# EAGLE design Neutron 1.4 (EAGLE 5.11)

## Sheet 1 of 4
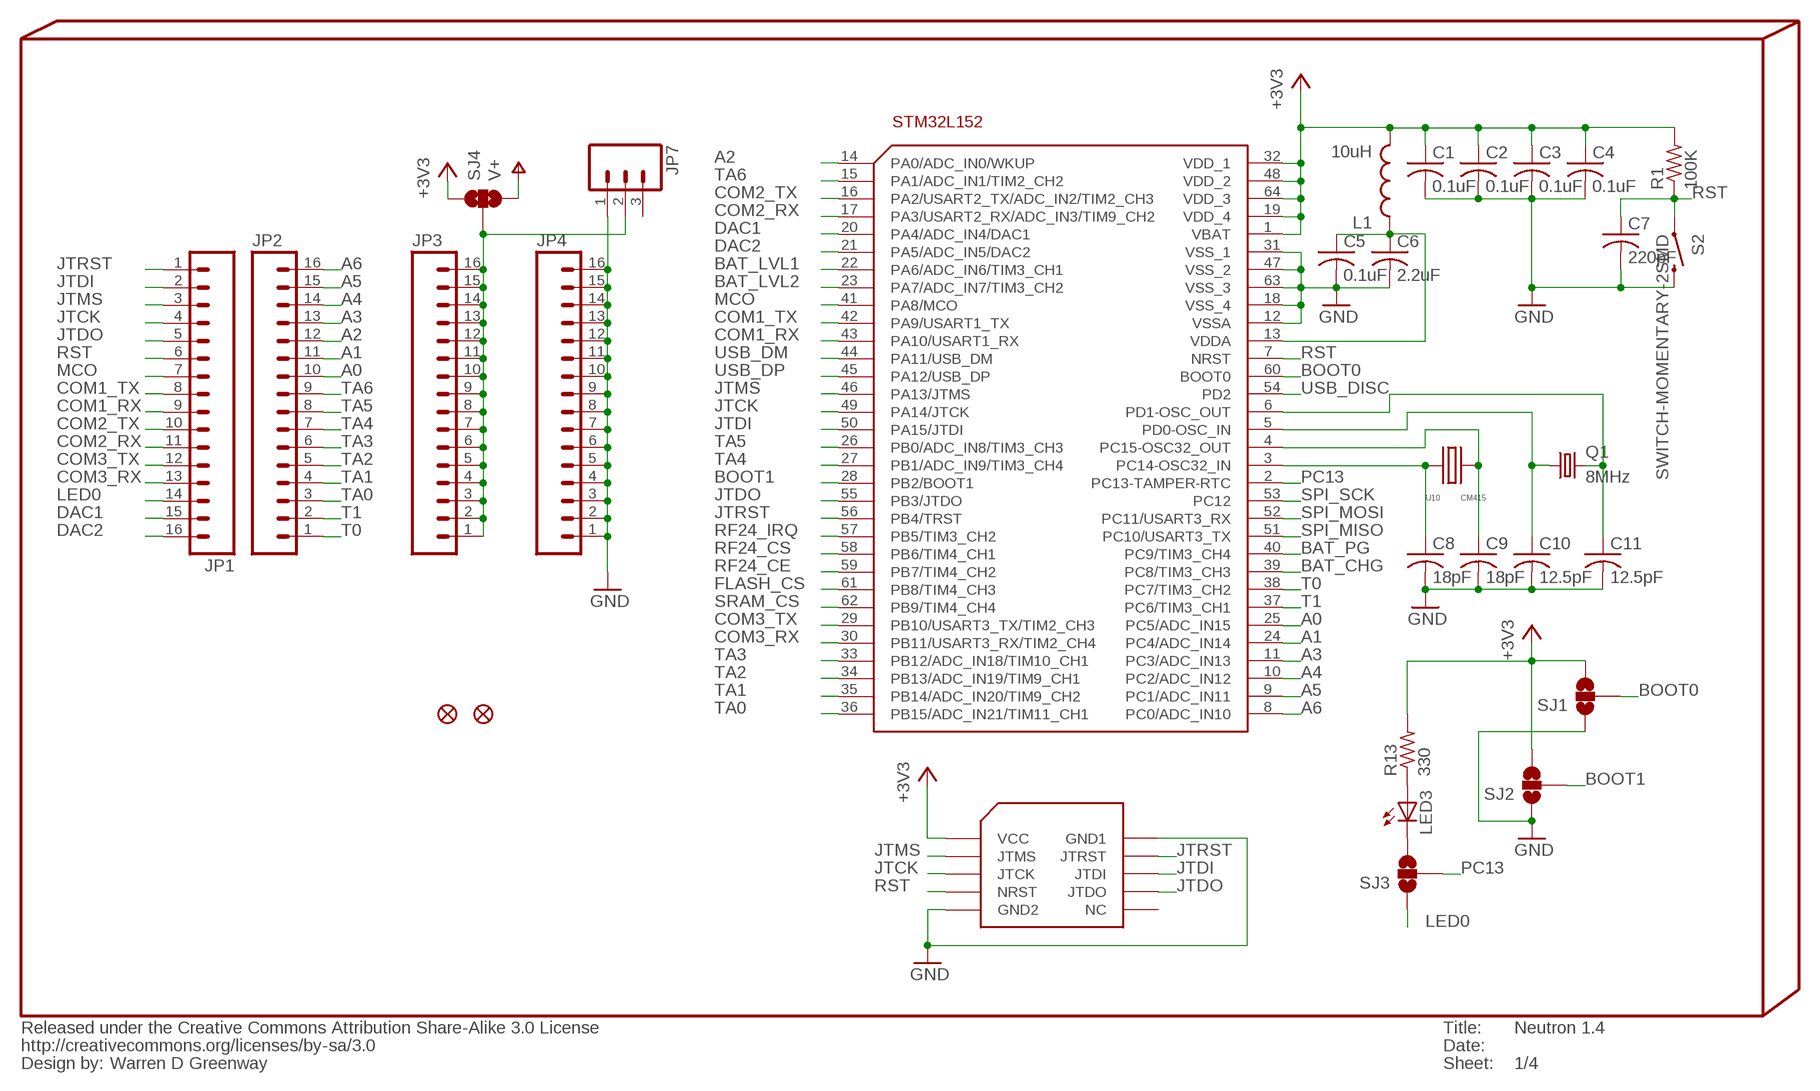
[diagram p0: schematic, sheet 1]

### Parts
C1  0.1uF  C-USC0402  [C0402]
C2  0.1uF  C-USC0402  [C0402]
C3  0.1uF  C-USC0402  [C0402]
C4  0.1uF  C-USC0402  [C0402]
C5  0.1uF  C-USC0402  [C0402]
C6  2.2uF  C-USC0402  [C0402]
C7  220pF  C-USC0402  [C0402]
C8  18pF  C-USC0402  [C0402]
C9  18pF  C-USC0402  [C0402]
C10  12.5pF  C-USC0402  [C0402]
C11  12.5pF  C-USC0402  [C0402]
INFO4  Warren D Greenway  CC-BY-SA  [CC-BY-SA]
JP1  M16ALTSILKLAYER  [1X16SS]
JP2  M16ALTSILKLAYER  [1X16SS]
JP3  M16ALTSILKLAYER  [1X16SS]
JP4  M16ALTSILKLAYER  [1X16SS]
JP7  M03ALTSILKLAYER  [1X03SS]
JP8  FIDUCIAL1.5X3  [FIDUCIAL-1.5X3]
JP9  FIDUCIAL1.5X3  [FIDUCIAL-1.5X3]
L1  10uH  INDUCTOR0603  [0603]
LED3  LED0603  [LED-0603]
Q1  8MHz  CRYSTAL5X3  [CRYSTAL-SMD-5X3]
R1  100K  R-US_R0402  [R0402]
R13  330  R-US_R0402  [R0402]
S2  SWITCH-MOMENTARY-2SMD  [SPARKFUN_TACTILE_SWITCH_SMD]
SJ1  SOLDERJUMPER_2WAYS  [SJ_3]
SJ2  SOLDERJUMPER_2WAYS  [SJ_3]
SJ3  SOLDERJUMPER_2WAYS  [SJ_3]
SJ4  SOLDERJUMPER_2WAYT  [SJ_2]
U1  STM32L152  [S-PQFP64-G64]
U10  CM415  [CM415]
U$2  STM32-JTAG-10P  [STM32-JTAG-10P]

### Nets
+3V3: C1.1 C2.1 C3.1 C4.1 L1.2 R1.2 R13.2 SJ1.3 SJ2.3 SJ4.1 U1.1(VBAT) U1.19(VDD_4) U1.32(VDD_1) U1.48(VDD_2) U1.64(VDD_3) U$2.P$1(VCC) ; also sheet 2,3,4
A0: JP2.10 U1.25(PC5/ADC_IN15)
A1: JP2.11 U1.24(PC4/ADC_IN14)
A2: JP2.12 U1.14(PA0/ADC_IN0/WKUP)
A3: JP2.13 U1.11(PC3/ADC_IN13)
A4: JP2.14 U1.10(PC2/ADC_IN12)
A5: JP2.15 U1.9(PC1/ADC_IN11)
A6: JP2.16 U1.8(PC0/ADC_IN10)
BAT_CHG: U1.39(PC8/TIM3_CH3) ; also sheet 3
BAT_LVL1: U1.22(PA6/ADC_IN6/TIM3_CH1) ; also sheet 3
BAT_LVL2: U1.23(PA7/ADC_IN7/TIM3_CH2) ; also sheet 3
BAT_PG: U1.40(PC9/TIM3_CH4) ; also sheet 3
BOOT0: SJ1.2 U1.60(BOOT0)
BOOT1: SJ2.2 U1.28(PB2/BOOT1)
COM1_RX: JP1.9 U1.43(PA10/USART1_RX)
COM1_TX: JP1.8 U1.42(PA9/USART1_TX)
COM2_RX: JP1.11 U1.17(PA3/USART2_RX/ADC_IN3/TIM9_CH2)
COM2_TX: JP1.10 U1.16(PA2/USART2_TX/ADC_IN2/TIM2_CH3)
COM3_RX: JP1.13 U1.30(PB11/USART3_RX/TIM2_CH4)
COM3_TX: JP1.12 U1.29(PB10/USART3_TX/TIM2_CH3)
DAC1: JP1.15 U1.20(PA4/ADC_IN4/DAC1)
DAC2: JP1.16 U1.21(PA5/ADC_IN5/DAC2)
FLASH_CS: U1.61(PB8/TIM4_CH3) ; also sheet 4
GND: C1.2 C2.2 C3.2 C4.2 C5.2 C6.2 C7.2 C8.2 C9.2 C10.2 C11.2 JP4.1 JP4.2 JP4.3 JP4.4 JP4.5 JP4.6 JP4.7 JP4.8 JP4.9 JP4.10 JP4.11 JP4.12 JP4.13 JP4.14 JP4.15 JP4.16 JP7.1 S2.3 SJ1.1 SJ2.1 U1.12(VSSA) U1.18(VSS_4) U1.31(VSS_1) U1.47(VSS_2) U1.63(VSS_3) U$2.P$2(GND1) U$2.P$9(GND2) ; also sheet 2,3,4
JTCK: JP1.4 U1.49(PA14/JTCK) U$2.P$5(JTCK)
JTDI: JP1.2 U1.50(PA15/JTDI) U$2.P$6(JTDI)
JTDO: JP1.5 U1.55(PB3/JTDO) U$2.P$8(JTDO)
JTMS: JP1.3 U1.46(PA13/JTMS) U$2.P$3(JTMS)
JTRST: JP1.1 U1.56(PB4/TRST) U$2.P$4(JTRST)
LED0: JP1.14 SJ3.1
MCO: JP1.7 U1.41(PA8/MCO)
N$1: C5.1 C6.1 L1.1 U1.13(VDDA)
N$2: C8.1 U1.3(PC14-OSC32_IN) U10.P$1(XIN)
N$4: C9.1 U1.4(PC15-OSC32_OUT) U10.P$2(XOUT)
N$5: C10.1 Q1.1 U1.5(PD0-OSC_IN)
N$6: C11.1 Q1.3 U1.6(PD1-OSC_OUT)
N$26: JP3.1 JP3.2 JP3.3 JP3.4 JP3.5 JP3.6 JP3.7 JP3.8 JP3.9 JP3.10 JP3.11 JP3.12 JP3.13 JP3.14 JP3.15 JP3.16 JP7.2 SJ4.2
N$35: LED3.C SJ3.3
N$36: LED3.A R13.1
PC13: SJ3.2 U1.2(PC13-TAMPER-RTC)
RF24_CE: U1.59(PB7/TIM4_CH2) ; also sheet 2
RF24_CS: U1.58(PB6/TIM4_CH1) ; also sheet 2
RF24_IRQ: U1.57(PB5/TIM3_CH2) ; also sheet 2
RST: C7.1 JP1.6 R1.1 S2.1 U1.7(NRST) U$2.P$7(NRST)
SPI_MISO: U1.51(PC10/USART3_TX) ; also sheet 2,4
SPI_MOSI: U1.52(PC11/USART3_RX) ; also sheet 2,4
SPI_SCK: U1.53(PC12) ; also sheet 2,4
SRAM_CS: U1.62(PB9/TIM4_CH4) ; also sheet 4
T0: JP2.1 U1.38(PC7/TIM3_CH2)
T1: JP2.2 U1.37(PC6/TIM3_CH1)
TA0: JP2.3 U1.36(PB15/ADC_IN21/TIM11_CH1)
TA1: JP2.4 U1.35(PB14/ADC_IN20/TIM9_CH2)
TA2: JP2.5 U1.34(PB13/ADC_IN19/TIM9_CH1)
TA3: JP2.6 U1.33(PB12/ADC_IN18/TIM10_CH1)
TA4: JP2.7 U1.27(PB1/ADC_IN9/TIM3_CH4)
TA5: JP2.8 U1.26(PB0/ADC_IN8/TIM3_CH3)
TA6: JP2.9 U1.15(PA1/ADC_IN1/TIM2_CH2)
USB_DISC: U1.54(PD2) ; also sheet 4
USB_DM: U1.44(PA11/USB_DM) ; also sheet 4
USB_DP: U1.45(PA12/USB_DP) ; also sheet 4
V+: SJ4.3 ; also sheet 3
Unconnected: JP7.3 U$2.P$10(NC)

## Sheet 2 of 4
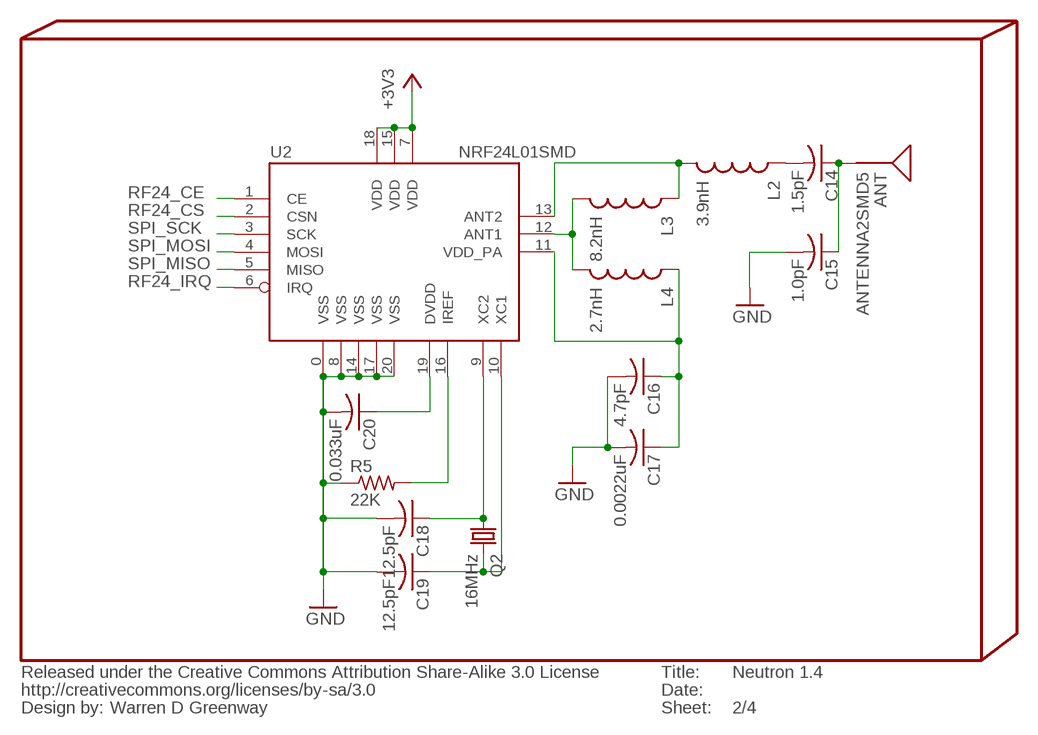
[diagram p1: schematic, sheet 2]

### Parts
ANT  ANTENNA2SMD5  [ANTENNA-CHIP5]
C14  1.5pF  C-USC0402  [C0402]
C15  1.0pF  C-USC0402  [C0402]
C16  4.7pF  C-USC0402  [C0402]
C17  0.0022uF  C-USC0402  [C0402]
C18  12.5pF  C-USC0402  [C0402]
C19  12.5pF  C-USC0402  [C0402]
C20  0.033uF  C-USC0402  [C0402]
L2  3.9nH  INDUCTOR0402  [C0402]
L3  8.2nH  INDUCTOR0402  [C0402]
L4  2.7nH  INDUCTOR0402  [C0402]
Q2  16MHz  CRYSTAL5X3  [CRYSTAL-SMD-5X3]
R5  22K  R-US_R0402  [R0402]
U2  NRF24L01SMD  [QFN20]

### Nets
+3V3: U2.7(VDD) U2.15(VDD) U2.18(VDD) ; also sheet 1,3,4
GND: C15.2 C16.2 C17.2 C18.2 C19.2 C20.2 R5.1 U2.0(VSS) U2.8(VSS) U2.14(VSS) U2.17(VSS) U2.20(VSS) ; also sheet 1,3,4
N$8: L3.2 L4.2 U2.12(ANT1)
N$10: ANT.FEED(SIGNAL) C14.1 C15.1
N$11: C14.2 L2.1
N$12: L2.2 L3.1 U2.13(ANT2)
N$13: C16.1 C17.1 L4.1 U2.11(VDD_PA)
N$14: C20.1 U2.19(DVDD)
N$15: R5.2 U2.16(IREF)
N$16: C18.1 Q2.1 U2.9(XC2)
N$17: C19.1 Q2.3 U2.10(XC1)
RF24_CE: U2.1(CE) ; also sheet 1
RF24_CS: U2.2(CSN) ; also sheet 1
RF24_IRQ: U2.6(IRQ) ; also sheet 1
SPI_MISO: U2.5(MISO) ; also sheet 1,4
SPI_MOSI: U2.4(MOSI) ; also sheet 1,4
SPI_SCK: U2.3(SCK) ; also sheet 1,4

## Sheet 3 of 4
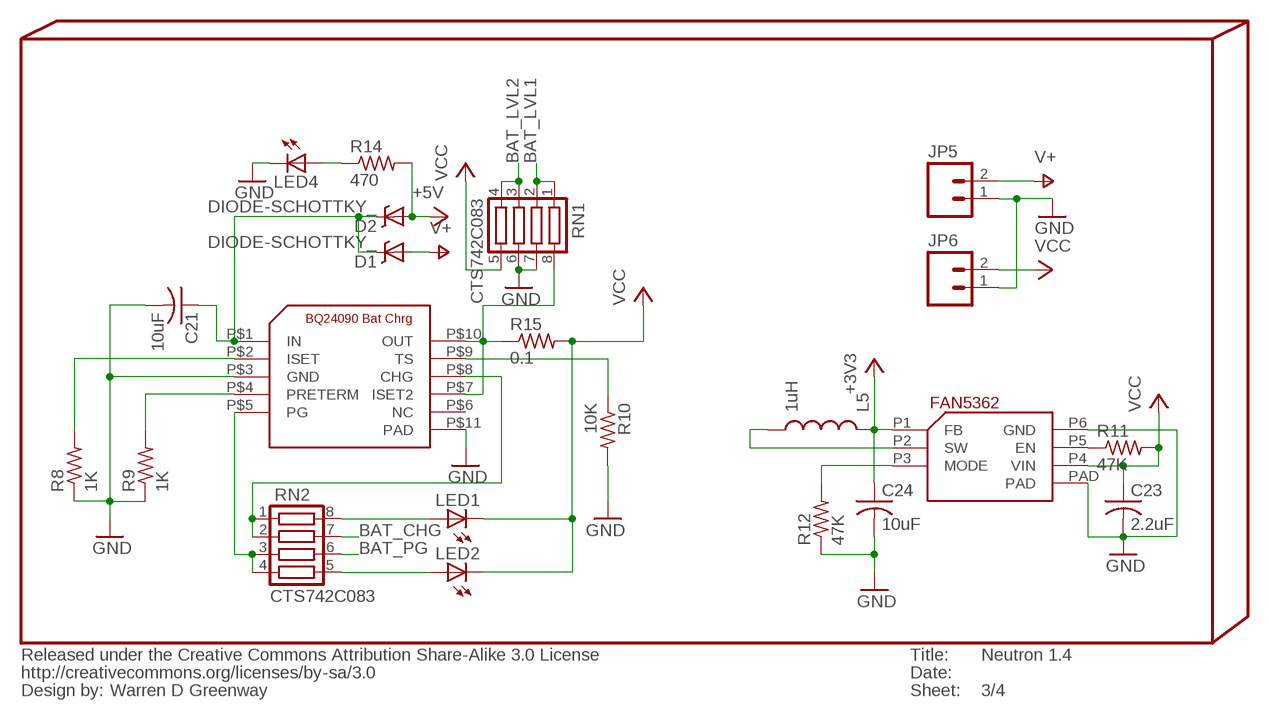
[diagram p2: schematic, sheet 3]

### Parts
C21  10uF  C-USC0805  [C0805]
C23  2.2uF  C-USC0402  [C0402]
C24  10uF  C-USC0805  [C0805]
D1  DIODE-SCHOTTKY_  [SMA-DIODE]
D2  DIODE-SCHOTTKY_  [SMA-DIODE]
JP5  M02JST-PTH-2  [JST-2-PTH]
JP6  M02JST-PTH-2  [JST-2-PTH]
L5  1uH  INDUCTOR0805  [0805]
LED1  LED0603  [LED-0603]
LED2  LED0603  [LED-0603]
LED4  LED0603  [LED-0603]
R8  1K  R-US_R0402  [R0402]
R9  1K  R-US_R0402  [R0402]
R10  10K  R-US_R0402  [R0402]
R11  47K  R-US_R0402  [R0402]
R12  47K  R-US_R0402  [R0402]
R14  470  R-US_R0402  [R0402]
R15  0.1  R-US_R0805  [R0805]
RN1  CTS742C083  [CTS742C083]
RN2  CTS742C083  [CTS742C083]
U3  BQ24090  [R-PDSO-G10]
U9  FAIRCHILD-REG-FAN5362  [MO229]

### Nets
+3V3: C24.1 L5.1 U9.P1(FB) ; also sheet 1,2,4
+5V: D2.A R14.2 ; also sheet 4
BAT_CHG: RN2.7 ; also sheet 1
BAT_LVL1: RN1.1 RN1.2 ; also sheet 1
BAT_LVL2: RN1.3 RN1.4 ; also sheet 1
BAT_PG: RN2.6 ; also sheet 1
GND: C21.2 C23.2 C24.2 JP5.1 JP6.1 LED4.C R8.1 R9.1 R10.2 R12.1 RN1.6 RN1.7 U3.P$3(GND) U3.P$11(PAD) U9.P6(GND) U9.PAD ; also sheet 1,2,4
N$18: R10.1 U3.P$9(TS)
N$19: RN2.3 RN2.4 U3.P$5(PG)
N$20: R9.2 U3.P$4(PRETERM)
N$21: R8.2 U3.P$2(ISET)
N$22: LED1.A RN2.8
N$24: LED2.A RN2.5
N$25: RN2.1 RN2.2 U3.P$8(CHG)
N$29: L5.2 U9.P2(SW)
N$31: LED4.A R14.1
N$32: R11.1 U9.P5(EN)
N$33: R12.2 U9.P3(MODE)
N$34: C21.1 D1.C D2.C U3.P$1(IN)
N$38: R15.1 RN1.8 U3.P$7(ISET2) U3.P$10(OUT)
V+: D1.A JP5.2 ; also sheet 1
VCC: C23.1 JP6.2 LED1.C LED2.C R11.2 R15.2 RN1.5 U9.P4(VIN)
Unconnected: U3.P$6(NC)

## Sheet 4 of 4
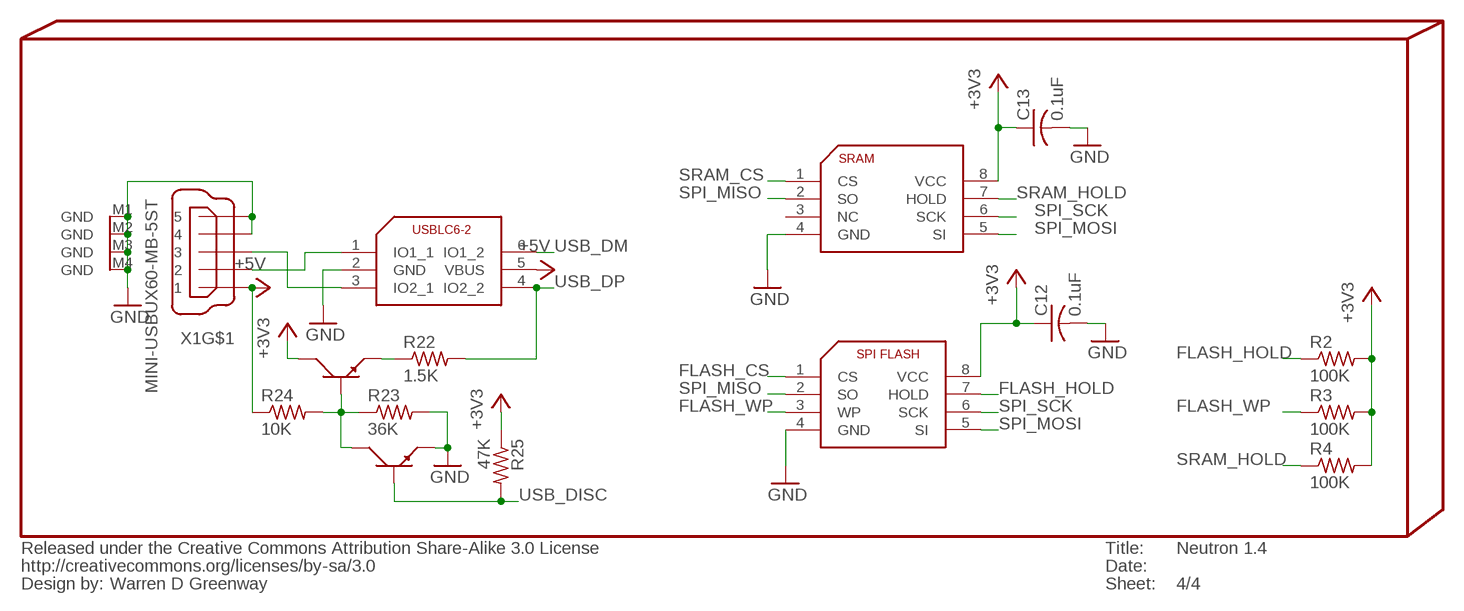
[diagram p3: schematic, sheet 4]

### Parts
C12  0.1uF  C-USC0402  [C0402]
C13  0.1uF  C-USC0402  [C0402]
R2  100K  R-US_R0402  [R0402]
R3  100K  R-US_R0402  [R0402]
R4  100K  R-US_R0402  [R0402]
R22  1.5K  R-US_R0402  [R0402]
R23  36K  R-US_R0402  [R0402]
R24  10K  R-US_R0402  [R0402]
R25  47K  R-US_R0402  [R0402]
U4  SST25VF080B  [DUBLIB_SOIC8]
U5  N25S0830HA  [TSSOP8]
U6  USBLC6-2  [SOT23-6L]
U7  BIPOLAR-PMBT6428  [DUBLIB_SOT23]
U8  BIPOLAR-PMBT6428  [DUBLIB_SOT23]
X1  MINI-USBUX60-MB-5ST  [DUBLIB_UX60-MB-5ST]

### Nets
+3V3: C12.1 C13.1 R2.2 R3.2 R4.2 R25.1 U4.8(VCC) U5.8(VCC) U7.3 ; also sheet 1,2,3
+5V: R24.1 U6.5(VBUS) X1.1 ; also sheet 3
FLASH_CS: U4.1(CS) ; also sheet 1
FLASH_HOLD: R2.1 U4.7(HOLD)
FLASH_WP: R3.1 U4.3(WP)
GND: C12.2 C13.2 R23.2 U4.4(GND) U5.4(GND) U6.2(GND) U8.2 X1.4 X1.5 X1.M1(GND) X1.M2(GND) X1.M3(GND) X1.M4(GND) ; also sheet 1,2,3
N$27: U6.3(IO2_1) X1.3
N$28: U6.1(IO1_1) X1.2
N$39: R23.1 R24.2 U7.1 U8.3
N$40: R22.1 U7.2
SPI_MISO: U4.2(SO) U5.2(SO) ; also sheet 1,2
SPI_MOSI: U4.5(SI) U5.5(SI) ; also sheet 1,2
SPI_SCK: U4.6(SCK) U5.6(SCK) ; also sheet 1,2
SRAM_CS: U5.1(CS) ; also sheet 1
SRAM_HOLD: R4.1 U5.7(HOLD)
USB_DISC: R25.2 U8.1 ; also sheet 1
USB_DM: U6.6(IO1_2) ; also sheet 1
USB_DP: R22.2 U6.4(IO2_2) ; also sheet 1
Unconnected: U5.3(NC)

## Library data of the parts
ANT = Pygmy:ANTENNA2: Antenna Single endded antenna. Common with smaller chip antennas. CHIP4 package is the GPS Chip Antenna SKU: GPS-08418. CHIP5 package is 2.4GHz chip antenna SKU: WRL-00144.
C1-C21 C23 C24 = rcl:C-US: CAPACITOR, American symbol
D1 D2 = SparkFun:DIODE-SCHOTTKY
INFO4 = Custom16:CC-BY-SA: Creative Commons Attribution-ShareAlike License <http://creativecommons.org/licenses/by-sa/3.0/>
JP1-JP4 = Pygmy:M16
JP5 JP6 = SparkFun:M02: Header 2 Standard 2-pin 0.1" header. Use with straight break away headers (SKU : PRT-00116), right angle break away headers (PRT-00553), swiss pins (PRT-00743), machine pins (PRT-00117), and female headers (PRT-00115). Molex polarized connector foot print use with SKU : PRT-08233 with associated crimp pins and housings.
JP7 = Pygmy:M03: Header 3 Standard 3-pin 0.1" header. Use with straight break away headers (SKU : PRT-00116), right angle break away headers (PRT-00553), swiss pins (PRT-00743), machine pins (PRT-00117), and female headers (PRT-00115). Molex polarized connector foot print use with SKU : PRT-08232 with associated crimp pins and housings.
JP8 JP9 = SparkFun:FIDUCIAL: Fiducial Alignment Points Various fiducial points for machine vision alignment.
L1-L4 = Pygmy:INDUCTOR: Inductors Basic Inductor/Choke - 0603 and 1206. Footprints are not proven and vary greatly between part numbers.
L5 = SparkFun:INDUCTOR: Inductors Basic Inductor/Choke - 0603 and 1206. Footprints are not proven and vary greatly between part numbers.
LED1-LED4 = SparkFun:LED: LEDs Standard schematic elements and footprints for 5mm, 3mm, 1206, and 0603 sized LEDs. 5mm - Spark Fun Electronics SKU : COM-00529 (and others)
Q1 Q2 = Pygmy:CRYSTAL: Crystals Various standard crystals. Proven footprints. Spark Fun Electronics SKU : COM-00534
R1-R5 R8-R15 R22-R25 = rcl:R-US_: RESISTOR, American symbol
RN1 RN2 = resistor-net:CTS742C083: Chip Resistor Array 4 Single Resistor Source: http://www.ctscorp.com/components/Datasheets/CTSChipArrayDs.pdf
S2 = Pygmy:SWITCH-MOMENTARY-2
SJ1-SJ4 = Pygmy:SOLDERJUMPER_2WAY: Solder Jumper 2 way solder jumper
U1 = Pygmy:STM32L152
U2 = Pygmy:NRF24L01: 2.4GHz Low Power Transceiver This is the very popular, low cost, very low power RF transceiver from Nordic Semiconductor. Simple SPI interface. SKU: COM-00690
U3 = Pygmy:BQ24090
U4 = Pygmy:SST25VF080B
U5 = Pygmy:N25S0830HA
U6 = Pygmy:USBLC6-2
U7 U8 = Pygmy:BIPOLAR-PMBT6428
U9 = Pygmy:FAIRCHILD-REG-FAN5362
U10 = Pygmy:CM415
U$2 = Pygmy:STM32-JTAG-10P
X1 = Pygmy:MINI-USB: MINI USB Connector Source: http://www.hirose.co.jp/cataloge_hp/e24000019.pdf

## Board
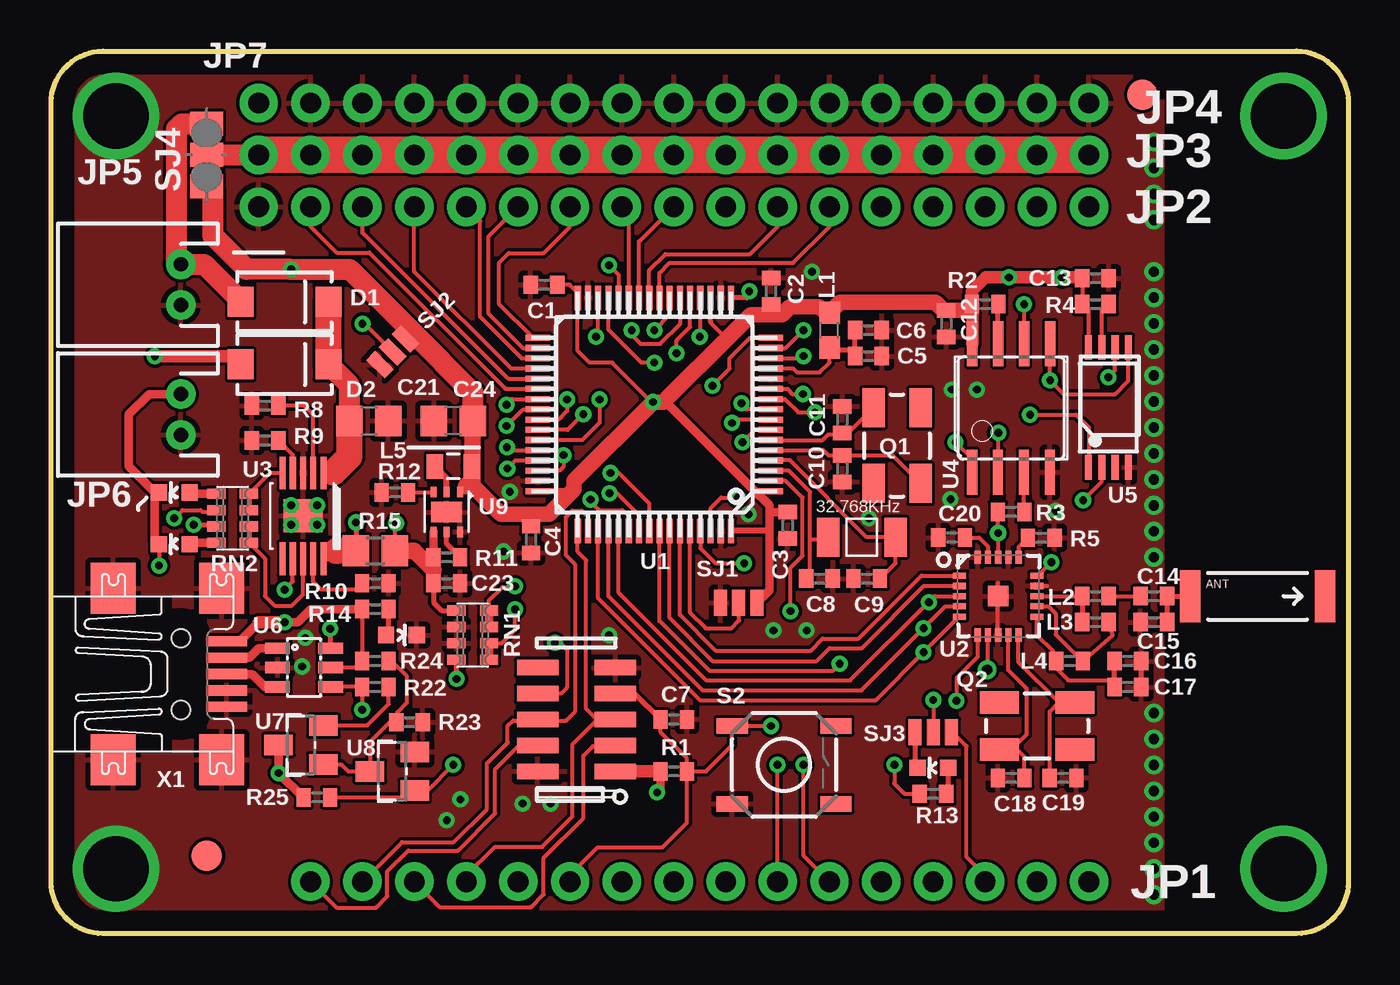
[diagram p4: board, top side]
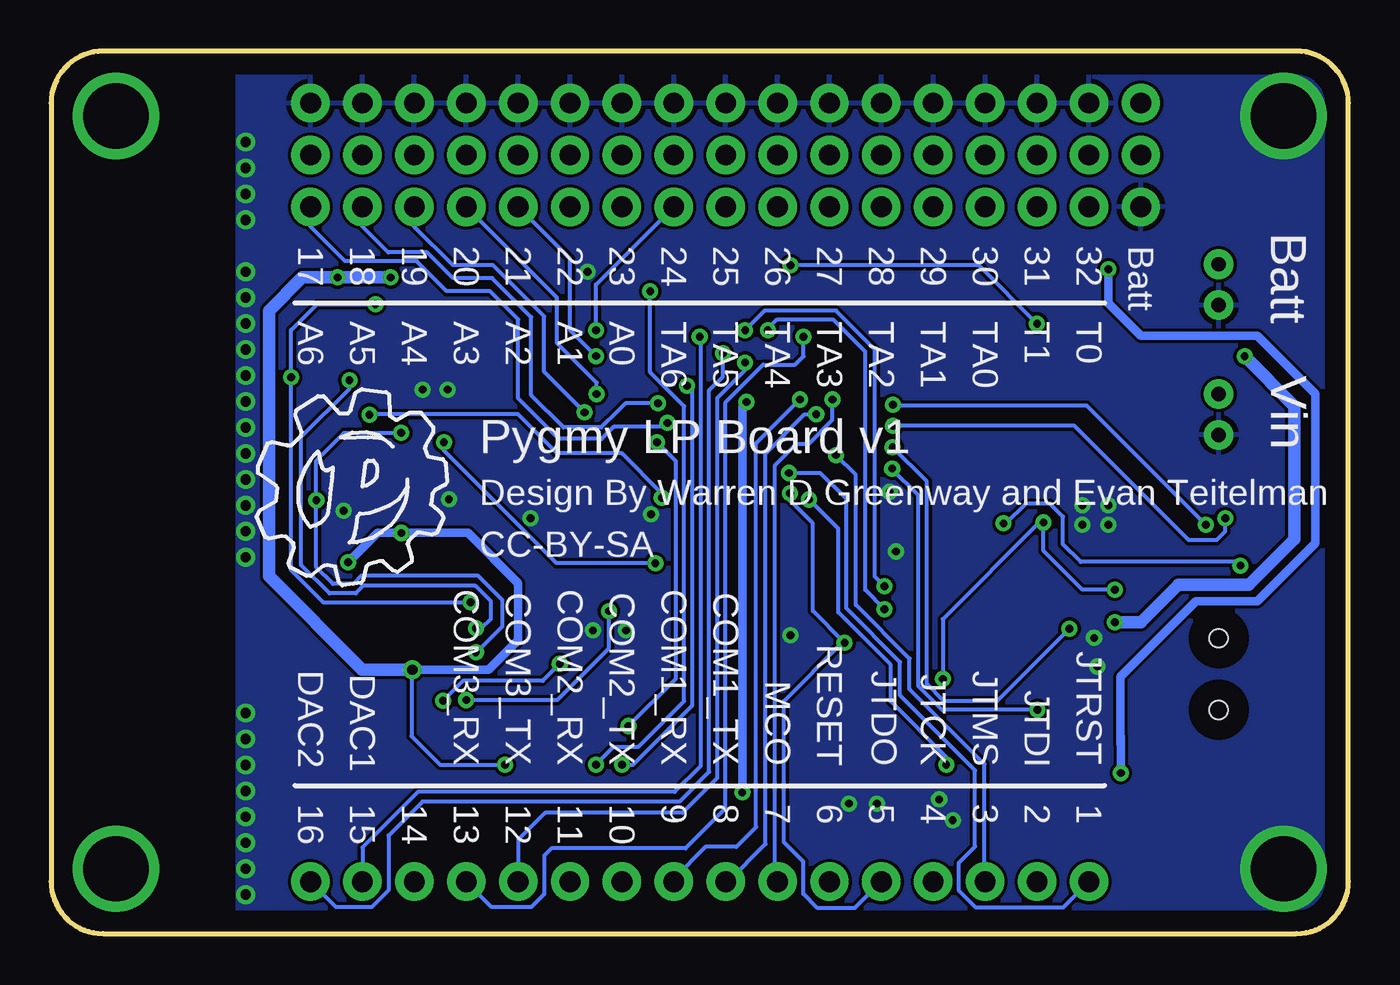
[diagram p5: board, bottom side, seen from below]

Size 63.5 x 43.18 mm. Coordinates in mm from the lower left corner, seen from the top.
Outline: 2.54,0 arc-90 0,2.54 0,40.64 arc-90 2.54,43.18 60.96,43.18 arc-90 63.5,40.64 63.5,2.54 arc-90 60.96,0 2.54,0
Copper layers (1*16): Top 0.035mm / dielectric 1.5mm / Bottom 0.035mm
Design rules "AdvancedCircuits": minimum track width 6mil, minimum drill 15mil, track to track 6mil, track to pad 6mil, pad to pad 4mil, via to via 6mil, smd to smd 4mil, copper to edge 40mil, drill to drill 8mil, minimum pad ring 10mil, minimum via ring 8mil, stop-mask expansion 4mil, vias tented up to drill 0mil, thermal gap 10mil
tRestrict: 2 lines
bRestrict: 1 lines

### Footprints (pad centres in the part's own frame; a part is rotated, then mirrored left to right if it is on the bottom)
ANTENNA-CHIP5 = smd 1.016 x 2.54: FEED -3.302,0; NC 3.302,0
C0402 = smd 0.7 x 0.9: 1 -0.65,0; 2 0.65,0
C0805 = smd 1.3 x 1.5: 1 -0.95,0; 2 0.95,0
SMA-DIODE = smd 1.27 x 1.47: A -2.15,0; C 2.15,0
1X16SS = drill 1.016 pad 1.88 round: 1 0,0; 2 2.54,0; 3 5.08,0; 4 7.62,0; 5 10.16,0; 6 12.7,0; 7 15.24,0; 8 17.78,0; 9 20.32,0; 10 22.86,0; 11 25.4,0; 12 27.94,0; 13 30.48,0; 14 33.02,0; 15 35.56,0; 16 38.1,0
JST-2-PTH = drill 0.7 pad 1.448 round: 1 -1,0; 2 1,0
1X03SS = drill 1.016 pad 1.88 round: 1 0,0; 2 2.54,0; 3 5.08,0
FIDUCIAL-1.5X3 = smd 1.5 x 1.5: 1 0,0
0603 = smd 1.1 x 1: 1 -0.85,0; 2 0.85,0
0805 = smd 0.8 x 1.2: 1 -0.9,0; 2 0.9,0
LED-0603 = smd 0.8 x 0.8: A 0,-0.75; C 0,0.75
CRYSTAL-SMD-5X3 = smd 1.9 x 1.1: 1 -1.85,-1.15; 2 1.85,-1.15; 3 1.85,1.15; 4 -1.85,1.15
R0402 = smd 0.7 x 0.9: 1 -0.65,0; 2 0.65,0
R0805 = smd 1.3 x 1.5: 1 -0.95,0; 2 0.95,0
CTS742C083 = smd 0.5 x 0.9: 1 -1.2,-0.8; 2 -0.4,-0.8; 3 0.4,-0.8; 4 1.2,-0.8; 5 1.2,0.8; 6 0.4,0.8; 7 -0.4,0.8; 8 -1.2,0.8
SPARKFUN_TACTILE_SWITCH_SMD = smd 1.524 x 0.762: 1 -2.54,1.905; 2 2.54,1.905; 3 -2.54,-1.905; 4 2.54,-1.905
SJ_3 = smd 0.635 x 1.27: 1 -0.889,0; 2 0,0; 3 0.889,0
SJ_2 = smd 1.168 x 1.6: 1 -1.524,0; 2 0,0; 3 1.524,0
S-PQFP64-G64 = smd 1.2 x 0.3: 1 -5.7,3.75; 2 -5.7,3.25; 3 -5.7,2.75; 4 -5.7,2.25; 5 -5.7,1.75; 6 -5.7,1.25; 7 -5.7,0.75; 8 -5.7,0.25; 9 -5.7,-0.25; 10 -5.7,-0.75; 11 -5.7,-1.25; 12 -5.7,-1.75; 13 -5.7,-2.25; 14 -5.7,-2.75; 15 -5.7,-3.25; 16 -5.7,-3.75; 33 5.7,-3.75; 34 5.7,-3.25; 35 5.7,-2.75; 36 5.7,-2.25; 37 5.7,-1.75; 38 5.7,-1.25; 39 5.7,-0.75; 40 5.7,-0.25; 41 5.7,0.25; 42 5.7,0.75; 43 5.7,1.25; 44 5.7,1.75; 45 5.7,2.25; 46 5.7,2.75; 47 5.7,3.25; 48 5.7,3.75 | smd 0.3 x 1.2: 17 -3.75,-5.7; 18 -3.25,-5.7; 19 -2.75,-5.7; 20 -2.25,-5.7; 21 -1.75,-5.7; 22 -1.25,-5.7; 23 -0.75,-5.7; 24 -0.25,-5.7; 25 0.25,-5.7; 26 0.75,-5.7; 27 1.25,-5.7; 28 1.75,-5.7; 29 2.25,-5.7; 30 2.75,-5.7; 31 3.25,-5.7; 32 3.75,-5.7; 49 3.75,5.7; 50 3.25,5.7; 51 2.75,5.7; 52 2.25,5.7; 53 1.75,5.7; 54 1.25,5.7; 55 0.75,5.7; 56 0.25,5.7; 57 -0.25,5.7; 58 -0.75,5.7; 59 -1.25,5.7; 60 -1.75,5.7; 61 -2.25,5.7; 62 -2.75,5.7; 63 -3.25,5.7; 64 -3.75,5.7
QFN20 = smd 1 x 1: 0 0,0 | smd 0.65 x 0.3: 1 -1.9,1; 2 -1.9,0.5; 3 -1.9,0; 4 -1.9,-0.5; 5 -1.9,-1; 11 1.9,-1; 12 1.9,-0.5; 13 1.9,0; 14 1.9,0.5; 15 1.9,1 | smd 0.3 x 0.65: 6 -1,-1.9; 7 -0.5,-1.9; 8 0,-1.9; 9 0.5,-1.9; 10 1,-1.9; 16 1,1.9; 17 0.5,1.9; 18 0,1.9; 19 -0.5,1.9; 20 -1,1.9
R-PDSO-G10 = smd 0.3 x 1.6: P$1 0,0; P$2 0.5,0; P$3 1,0; P$4 1.5,0; P$5 2,0; P$6 2,4.2; P$7 1.5,4.2; P$8 1,4.2; P$9 0.5,4.2; P$10 0,4.2 | smd 1.9 x 1.6: P$11 1,2.1
DUBLIB_SOIC8 = smd 0.5 x 2.2: 1 -1.905,-3.154; 2 -0.645,-3.154; 3 0.625,-3.154; 4 1.895,-3.154; 5 1.905,3.154; 6 0.635,3.154; 7 -0.635,3.154; 8 -1.905,3.154
TSSOP8 = smd 1.2 x 0.35: 1 -2.925,0.975; 2 -2.925,0.325; 3 -2.925,-0.325; 4 -2.925,-0.975; 5 2.925,-0.975; 6 2.925,-0.325; 7 2.925,0.325; 8 2.925,0.975
SOT23-6L = smd 0.55 x 1.2: 1 -0.95,-1.3; 2 0,-1.3; 3 0.95,-1.3; 4 0.95,1.3; 5 0,1.3; 6 -0.95,1.3
DUBLIB_SOT23 = smd 1 x 1.4: 1 -0.95,-1.1; 2 0.95,-1.1; 3 0,1.1
MO229 = smd 0.3 x 0.5: P1 -0.65,-0.65; P2 0,-0.65; P3 0.65,-0.65; P4 0.65,1.3; P5 0,1.3; P6 -0.65,1.3 | smd 1.5 x 1: PAD 0.01,0.33
CM415 = smd 1.1 x 1.9: P$1 0,0; P$2 3.3,0
STM32-JTAG-10P = smd 0.762 x 2.032: P$1 0,0; P$2 0,3.81; P$3 1.27,0; P$4 1.27,3.81; P$5 2.54,0; P$6 2.54,3.81; P$7 3.81,0; P$8 3.81,3.81; P$9 5.08,0; P$10 5.08,3.81
DUBLIB_UX60-MB-5ST = smd 2 x 0.5: 1 2.25,1.6; 2 2.25,0.8; 3 2.25,0; 4 2.25,-0.8; 5 2.25,-1.6 | smd 2.2 x 2.5: M1 -3.3,-4.2; M2 -3.3,4.2; M3 2,4.2; M4 2,-4.2 | hole 0.9: 0,-1.75; 0,1.75

### Placement (x,y rotation side)
ANT  59.06,16.51 0 top
C1  24.13,31.75 180 top
C2  35.24,31.43 90 top
C3  36.06,19.98 270 top
C4  23.49,19.28 270 top
C5  40.01,28.26 0 top
C6  40.01,29.53 0 top
C7  30.48,10.48 0 top
C8  37.61,17.37 0 top
C9  39.92,17.37 180 top
C10  38.73,22.75 270 top
C11  38.73,25.15 90 top
C12  43.82,29.84 270 top
C13  51.12,32.07 0 top
C14  53.98,16.51 180 top
C15  53.98,15.24 180 top
C16  52.7,13.33 0 top
C17  52.7,12.06 0 top
C18  46.99,7.62 180 top
C19  49.53,7.62 0 top
C20  44.07,19.38 180 top
C21  15.56,25.08 0 top
C23  19.37,17.15 0 top
C24  19.69,25.08 180 top
D1  11.43,30.91 0 top
D2  11.43,27.85 0 top
INFO4  -5.07,-12.7 0 top  (outside the outline)
JP1  12.7,2.54 0 top
JP2  12.7,35.56 0 top
JP3  12.7,38.1 0 top
JP4  12.7,40.64 0 top
JP5  6.35,31.75 90 top
JP6  6.35,25.4 90 top
JP7  10.16,35.56 90 top
JP8  7.62,3.81 0 top
JP9  53.42,41.05 0 top
L1  38.1,29.53 90 top
L2  51.12,16.51 180 top
L3  51.12,15.24 0 top
L4  49.85,13.33 0 top
L5  19.69,22.86 180 top
LED1  6.03,19.05 90 top
LED2  6.03,21.59 90 top
LED3  43.17,8.11 90 top
LED4  17.15,14.6 270 top
Q1  41.41,23.88 90 top
Q2  48.26,10.16 0 top
R1  30.48,7.94 180 top
R2  45.72,30.8 180 top
R3  46.99,20.64 180 top
R4  51.12,30.8 180 top
R5  48.46,19.37 180 top
R8  10.48,25.83 0 top
R9  10.48,24.13 0 top
R10  15.87,17.15 0 top
R11  19.37,18.41 180 top
R12  16.83,21.59 0 top
R13  43.17,6.84 180 top
R14  15.87,15.87 180 top
R15  15.87,18.73 0 top
R22  15.87,12.06 180 top
R23  17.55,10.34 0 top
R24  15.87,13.33 0 top
R25  13.01,6.67 0 top
RN1  20.64,14.6 90 top
RN2  8.89,20.32 90 top
S2  35.88,8.26 0 top
SJ1  33.66,16.19 0 top
SJ2  16.72,28.46 45 top
SJ3  43.18,9.86 180 top
SJ4  7.62,38.1 90 top
U1  29.53,25.4 180 top
U2  46.36,16.51 0 top
U3  13.33,22.54 180 top
U4  46.99,25.72 0 top
U5  51.75,25.74 90 top
U6  12.38,13.02 270 top
U7  12.23,9.23 90 top
U8  16.7,7.94 90 top
U9  19.37,20.95 180 top
U10  38.03,19.4 0 top
U$2  27.62,7.94 90 top
X1  6.35,12.7 0 top

### Tracks (layer width: path | path; a pad name or v marks a point on that pad's centre or on a via)
+3V3  (via drill 0.38, 0.51)
  Top 0.203: C13.1 R4.2 50.78,30.49 U5.8 | 20.3,21.6 U9.P1 20.32,21.91 | U1.32 25.78,28.52 26.36,27.93 27.46,27.93 29.39,26.01 v29.46,26.01 | U2.18 v46.36,19.6 46.34,19.62 R3.2 | v41.27,8.26 41.27,7.34 41.77,6.85 R13.2 | 25.78,31.36 25.38,31.75 C1.1 | 23.42,20.52 23.42,19.8 23.49,19.88 C4.1 | U$2.P$1 27.07,7.94 | v45.82,12.91 45.86,12.95 U2.7 | 32.28,29.95 32.28,29.89 33.07,29.1 33.18,29.21 | 35.76,30.28 35.75,30.28 C2.1 | SJ2.3 17.35,29.13 17.66,29.45 | 7.93,36.35 7.7,36.58 SJ4.1 | U2.15 48.3,17.51 v48.96,18.17
  Top 0.254: 32.28,29.95 U1.19 | U1.32 25.78,31.36
  Top 0.305: U1.64 35.12,19.7 35.15,19.66 | U1.1 34.45,21.65 34.35,21.75 | U1.48 25.09,21.65 25.3,21.44
  Top 0.406: U7.3 v11.13,7.86 v11.14,7.86 12.33,6.67 R25.1 | 27.07,7.94 26.99,7.86 | R1.2 29.83,7.07 v29.67,6.91 | SJ1.3 35.15,16.8 35.15,19.66 35.15,20.53 | C3.1 35.25,20.63 35.15,20.53 | 35.15,20.53 35.15,20.95 34.35,21.75 32.92,23.18 30.09,26.01 30.09,26.13 30.13,26.16
  Top 0.61: U4.8 45.09,30.78 R2.2 45.07,31.42 45.76,32.11 v46.88,32.11 v49.48,32.11 50.43,32.11 C13.1 | R1.2 U$2.P$1
  Top 0.762: R2.2 44.77,30.5 C12.1 43.67,30.5 43.28,30.89 38.61,30.89 L1.2 37.9,30.38 37.59,30.68 36.17,30.68 35.76,30.28 34.25,30.28 33.18,29.21 30.13,26.16 29.98,26.01 v29.46,26.01 25.6,22.15 25.6,21.74 25.3,21.44 24.38,20.52 23.42,20.52 22.02,20.52 20.64,21.91
  Top 0.813: 20.64,22.23 20.32,21.91 | 20.64,22.81 20.64,22.23 | 20.64,22.81 L5.1 | C24.1 20.64,22.81 | 20.64,22.23 20.64,21.91
  Top 1.016: 7.93,36.35 7.93,34.14 9.56,32.5 v11.75,32.5 14.6,32.5 17.66,29.45 20.64,26.47 C24.1
  Top 1.27: C24.1
  Bottom 0.203: v41.27,8.26 44.45,8.26 45.86,9.66 45.86,12.87 v45.82,12.91
  Bottom 0.406: v45.82,12.91 42.08,12.91 40.64,14.36 40.64,17.15 43.1,19.6 v46.36,19.6 47.53,19.6 48.76,18.38 v48.96,18.17 | 11.14,9.66 v11.14,7.86 v11.13,7.86 U7.3 11.17,9.27 11.17,12.56 7.47,16.26 4.47,16.26 1.63,19.1 1.63,26.42 4.47,29.26 10.16,29.26 11.75,30.85 v11.75,32.5 | v29.67,6.91 29.67,25.81 v29.46,26.01
  Bottom 0.61: v46.88,32.11 51.21,32.11 52.83,30.48 52.83,17.48 48.27,12.91 v45.82,12.91
+5V  (via drill 0.38)
  Top 0.203: U6.5 14.91,13.02 R24.1 R14.2 | D2.A 9.27,27.86 9.27,28.25
  Top 0.406: X1.1 9.22,14.3 10.16,15.24 | v11.43,15.24 12.06,15.24 12.7,15.87 R14.2
  Top 0.61: v11.43,15.24 10.16,15.24 | v5.08,28.25 9.27,28.25
  Bottom 0.61: v11.43,15.24 10.16,15.24 8.33,17.07 4.88,17.07 2.64,19.3 2.64,25.81 v5.08,28.25
A0
  Top 0.203: U1.25 29.28,32.45 30.07,33.25 34.21,33.25 35.56,34.59 JP2.10
A1
  Top 0.203: U1.24 29.78,32.32 30.28,32.82 36.32,32.82 38.1,34.59 JP2.11
A2  (via drill 0.38)
  Top 0.203: U1.14 36.72,28.15
  Top 0.254: 36.72,28.15 v36.83,28.26
  Bottom 0.203: v36.83,28.26 38.1,29.53 38.1,33.02 JP2.12
A3  (via drill 0.38)
  Top 0.203: U1.11 36.05,26.65 36.3,26.4 v36.8,26.4
  Bottom 0.203: v36.8,26.4 36.8,26.95 38.73,28.89 38.73,31.12 JP2.13
A4  (via drill 0.38)
  Top 0.203: U1.10 35.92,26.15 36.57,25.5 v37.39,25.5
  Bottom 0.203: v37.39,25.5 39.37,27.48 39.37,30.2 41.87,32.7 43.83,32.7 45.72,34.59 JP2.14
A5  (via drill 0.38)
  Top 0.203: U1.9 34.05,25.65 33.8,25.9 v33.8,25.94
  Bottom 0.203: v33.8,25.94 35.39,25.94 35.78,25.56 36.57,24.77 38.42,24.77 40.01,26.35 40.01,30.16 41.91,32.07 43.82,32.07 45.09,33.34 47,33.34 48.26,34.59 JP2.15
A6  (via drill 0.38)
  Top 0.203: U1.8 33.5,25.15 v33.33,24.99
  Bottom 0.203: v33.33,24.99 33.53,24.79 35.97,24.79 36.55,24.21 38.66,24.21 40.64,26.19 40.64,30.05 42.02,31.43 44.13,31.43 45.61,32.91 49.11,32.91 50.8,34.59 JP2.16
BAT_CHG  (via drill 0.38)
  Top 0.203: U1.39 22.58,26.15 v22.3,25.87
  Top 0.254: v6.98,20 8.01,20 RN2.7
  Bottom 0.203: v6.98,20 12.81,25.83 22.26,25.83 v22.3,25.87
BAT_LVL1  (via drill 0.38)
  Top 0.203: RN1.2 22.06,14.21 22.71,14.86 22.71,15.87 v22.7,15.87 | v28.42,29.52 28.42,29.29 28.85,28.85 29.81,28.85 30.8,29.84 30.8,31.08
  Top 0.254: 30.8,31.08 U1.22
  Top 0.406: RN1.1 RN1.2
  Bottom 0.203: v28.42,29.52 28.42,29.61 28,30.03 25.2,30.03 23.65,28.47 23.65,16.82 v22.7,15.87
BAT_LVL2  (via drill 0.38)
  Top 0.203: U1.23 30.28,30.28 v29.53,29.53 | RN1.4 21.44,16.3 22.09,16.96 22.67,16.96 v22.7,16.99
  Top 0.406: RN1.3 RN1.4
  Bottom 0.203: v29.53,29.53 28.58,30.48 25.08,30.48 23.18,28.58 23.18,17.46 v22.7,16.99
BAT_PG  (via drill 0.38)
  Top 0.203: U1.40 23.11,25.65 v22.3,24.84 | 8.01,20.64 7.4,20.64 7.31,20.73 6.44,20.73 v6.03,20.32
  Top 0.254: 8.01,20.64 RN2.6
  Bottom 0.203: v6.03,20.32 6.03,19.69 6.46,19.25 7.82,19.25 13.41,24.84 v22.3,24.84
BOOT0
  Top 0.203: U1.60 31.28,15.71 32.05,14.94 33.29,14.94 33.68,15.32 33.68,16.16 SJ1.2
BOOT1  (via drill 0.38)
  Top 0.203: U1.28 27.78,32.23 v27.3,32.7 | v15.24,29.84 15.34,29.84 SJ2.2
  Bottom 0.203: v27.3,32.7 18.1,32.7 v15.24,29.84
COM1_RX  (via drill 0.38)
  Top 0.203: U1.43 25.99,24.15 26.85,25.01 v26.85,26.13
  Bottom 0.203: JP1.9 33.02,2.69 31.47,4.24 29.96,4.24 29,5.21 29,23.98 v26.85,26.13
COM1_TX  (via drill 0.38)
  Top 0.203: U1.42 25.29,24.65 v26.05,25.41
  Bottom 0.203: v26.05,25.41 v26.06,25.4 26.62,25.4 28.53,23.49 28.53,4.39 30.38,2.54 30.48,2.64 JP1.8
COM2_RX  (via drill 0.38)
  Top 0.203: 34.05,31.1 34.05,31.3 v34.18,31.43 | v36.83,8.26 36.83,3.81 JP1.11
  Top 0.254: 34.05,31.1 U1.17
  Bottom 0.203: v36.83,8.26 36.83,8.29 35.97,9.14 34.75,9.14 32.51,11.38 32.51,25.81 34.18,27.47 v34.18,31.43
COM2_TX  (via drill 0.38)
  Top 0.203: JP1.10 v35.56,8.26 | U1.16 34.21,29.15 33.22,28.16 33.22,27.65 v32.38,26.81
  Bottom 0.203: v32.38,26.81 32.11,26.54 32.11,11.18 35.03,8.26 v35.56,8.26
COM3_RX  (via drill 0.38)
  Top 0.203: U1.30 26.78,29.32 v26.67,29.21
  Bottom 0.203: v26.67,29.21 26.67,28.25 27.08,27.84 28.65,27.84 30.48,26.01 30.48,6.13 32.44,4.18 39.01,4.18 39.37,3.81 39.37,1.93 40.01,1.29 41.94,1.29 JP1.13
COM3_TX  (via drill 0.38)
  Top 0.203: U1.29 27.28,29.55 28.89,27.94 v29.53,27.94
  Bottom 0.203: JP1.12 40.64,4.59 39.32,5.91 32.59,5.91 30.89,7.62 30.89,26.21 29.53,27.57 v29.53,27.94
DAC1  (via drill 0.38)
  Top 0.203: 31.78,29.24 U1.20
  Top 0.254: v31.75,29.21 31.78,29.24
  Bottom 0.203: 48.26,2.95 JP1.15 48.26,4.22 45.54,6.93 32.98,6.93 31.7,8.21 31.7,29.16 v31.75,29.21
DAC2  (via drill 0.38)
  Top 0.203: v30.62,28.4 30.62,29.02 31.28,29.68 U1.21
  Bottom 0.203: v30.62,28.4 30.62,27.26 31.29,26.58 31.29,7.91 32.75,6.45 45.32,6.45 46.98,4.79 46.98,2.12 47.81,1.29 49.55,1.29 JP1.16
FLASH_CS  (via drill 0.38)
  Top 0.203: U1.61 31.78,18.87 32.52,18.12 v33.93,18.12 | v44.27,24.04 45.09,23.23 U4.1
  Bottom 0.203: v33.93,18.12 38.76,18.12 44.27,23.63 v44.27,24.04
FLASH_HOLD
  Top 0.254: U4.7 46.36,30.78 R2.1
FLASH_WP
  Top 0.203: U4.3 47.62,20.64 R3.1
GND  (via drill 0.38, 0.51, 3.2)
  Top 0.203: U2.14 48.76,17.01 | U2.8 46.36,17.15
  Top 0.254: C17.2 C16.2
  other vias: 3.18,3.18 3.18,40.01 11.75,20.95 13.02,20.95 13.02,20 11.75,20 53.98,1.91 53.98,3.18 53.98,4.45 53.98,5.71 53.98,6.98 53.98,8.26 53.98,9.53 53.98,10.79 53.98,18.41 53.98,19.69 53.98,20.95 53.98,22.23 53.98,23.49 53.98,24.77 53.98,26.03 53.98,27.3 53.98,28.58 53.98,29.84 53.98,31.12 53.98,32.39 53.98,34.93 53.98,36.2 53.98,37.47 53.98,38.73 23.08,6.36 24.45,6.36 12.45,14.47 12.29,13.07 37.24,32.39 35.36,14.83 36.98,14.83 44.03,21.25 44.09,26.62 45.31,26.62 49.17,20.69 27.3,14.6 34.14,20.52 40.03,20.32 22.15,18.69 22.45,21.62 20.03,6.56 19.37,5.55
  pour Bottom: -5.08,48.26 68.58,48.26 68.58,-5.08 -5.08,-5.08
  pour Top: -2.54,45.72 66.04,45.72 66.04,-2.54 -2.54,-2.54
JTCK
  Top 0.203: U1.49 25.78,18.67 26.19,18.26 26.19,10.99 26.62,10.57 26.82,10.57 | 27.57,10.42 U$2.P$5 27.53,10.57 26.82,10.57 | 26.82,10.57 25.51,9.26 25.51,5.73 24.03,4.25 21.72,4.25 20.32,2.84 JP1.4
JTDI
  Top 0.203: U1.50 26.28,20.4 25.98,20.69 25.51,20.69 25.2,20.38 25.2,18.51 25.67,18.05 25.67,10.89 25.2,10.42 23.87,10.42 | 23.87,10.42 U$2.P$6 | 23.87,10.42 22.62,10.42 22.35,10.16 22.35,9.35 21.34,8.33 21.34,6.1 19.71,4.47 17.17,4.47 JP1.2
JTDO  (via drill 0.38)
  Top 0.203: U1.55 28.78,20.46 27.69,21.55 v27.34,21.55 | v24.66,14.24 24.9,14.24 25.24,13.89 25.24,12.04 24.95,11.75 U$2.P$8
  Bottom 0.203: v24.66,14.24 26.21,15.79 26.21,20.07 27.34,21.19 v27.34,21.55 | v24.66,14.24 24.69,14.21 | v24.66,14.24 24.78,14.24 27.64,11.38 27.64,4.47 26.68,3.52 26.68,1.94 25.98,1.24 24.17,1.24 JP1.5
JTMS  (via drill 0.38)
  Top 0.203: 24.52,22.65 U1.46 24.88,22.65 25.08,22.84 v25.08,23.41 | U$2.P$3 27.59,9.18 26.52,9.18 26.06,8.71 26.06,5.65 24.11,3.71 24.11,1.92 23.49,1.29 19.02,1.29 JP1.3
  Bottom 0.203: v25.08,23.41 24.11,22.45 24.11,16.08 21.49,13.45 21.49,11.97 17.81,8.29 17.81,2.98 17.78,2.95 JP1.3
JTRST  (via drill 0.38)
  Top 0.203: U1.56 29.28,21.05 27.79,22.53 v27.39,22.53 | 23.78,9.18 U$2.P$4 22.9,9.21 21.74,8.05 21.74,5.89 19.91,4.06 17.48,4.06 16.46,3.05 16.46,1.83 15.9,1.27 13.97,1.27 JP1.1
  Bottom 0.203: v27.39,22.53 25.85,22.53 24.58,21.27 24.58,15.92 21.94,13.28 21.94,11.65 18.28,7.99 18.28,4.25 19.06,3.47 19.06,2.09 18.23,1.27 13.97,1.27 JP1.1
LED0
  Top 0.203: SJ3.1 44.12,9.86 44.81,9.18 44.81,3.76 45.7,2.87 45.7,2.56 JP1.14
MCO  (via drill 0.38)
  Top 0.203: U1.41 24.83,25.15 25.26,25.58 v25.26,26.13
  Bottom 0.203: v25.26,26.13 25.26,25.14 26.42,23.98 27.01,23.98 28.06,22.92 28.06,2.66 JP1.7
N$1
  Top 0.203: U1.13 36.32,27.65 36.51,27.46 37.62,27.46 38.1,27.94 L1.1 38.2,28.58
  Top 0.254: C6.1 C5.1 39.04,28.58 38.2,28.58 37.78,28.58
N$2
  Top 0.203: U1.3 36.11,22.65 37.15,21.62 37.15,19.3 | 37.15,19.3 37.15,17.55 C8.1 | U10.P$1 37.94,19.3 37.15,19.3
N$4
  Top 0.203: U1.4 36.16,23.15 39.91,19.4 U10.P$2 41.33,18.13 C9.1
N$5
  Top 0.203: U1.5 37.8,23.65 38.04,23.41 38.71,23.41 C10.1 41.18,23.4 Q1.1
N$6
  Top 0.203: U1.6 37.76,24.15 38.04,24.42 38.66,24.42 C11.1 39.02,24.5 Q1.3
N$8
  Top 0.203: U2.12 48.81,16.01 49.17,15.65 49.17,14.63 50.47,13.33 L4.2 51.97,14.6 L3.2
N$10
  Top 0.254: ANT.FEED C14.1 C15.1
N$11
  Top 0.203: L2.1 C14.2
N$12
  Top 0.203: U2.13 L2.2
  Top 0.254: L2.2 L3.1
N$13
  Top 0.203: U2.11 48.26,14.61 49,13.87 L4.1 49,13.18 49.78,12.4 51.73,12.4 C17.1
  Top 0.254: C17.1 C16.1
N$14
  Top 0.203: U2.19 45.86,18.94 45.43,19.37 44.73,19.37 C20.1
N$15
  Top 0.203: 47.61,19.37 R5.2 47.36,18.91 U2.16
N$16
  Top 0.203: U2.9 46.86,12.89 47.75,11.99 47.75,9.75 47.14,9.14 | 47.14,9.14 46.54,9.14 Q2.1 | C18.1 47.64,8.65 47.14,9.14
N$17
  Top 0.203: U2.10 47.36,13.29 49.33,11.31 | 49.33,11.31 Q2.3 | C19.1 48.88,10.86 49.33,11.31
N$18
  Top 0.203: U3.P$9 12.83,17.21 13.22,16.83 14.91,16.83
  Top 0.254: R10.1 14.91,16.83
N$19
  Top 0.203: U3.P$5 10.71,22.54 RN2.4
  Top 0.254: RN2.4 RN2.3
N$20
  Top 0.203: U3.P$4 11.83,23.42 R9.2
N$21
  Top 0.203: U3.P$2 12.83,25.39 12.4,25.83 R8.2
N$22
  Top 0.406: RN2.8 6.85,19.12 LED1.A
N$24
  Top 0.406: RN2.5 6.85,21.52 LED2.A
N$25
  Top 0.203: RN2.1 10.48,18.33 10.48,16.51 10.94,16.05 11.79,16.05 12.33,16.6 U3.P$8
  Top 0.254: RN2.2 RN2.1
N$26
  Top 0.203: 9.96,38.53 10.06,38.53 10.06,38.2 JP7.2
  Top 1.016: SJ4.2 JP7.2
  Top 1.778: JP3.16 JP3.15 JP3.14 JP3.13 JP3.12 JP3.11 JP3.10 JP3.9 JP3.8 JP3.7 JP3.6 JP3.5 JP3.4 JP3.3 JP3.2 JP3.1 JP7.2
N$27
  Top 0.406: X1.3 9.84,12.7 10.48,12.06 U6.3
N$28
  Top 0.406: X1.2 9.69,13.5 10.16,13.97 U6.1
N$29
  Top 0.305: U9.P2 19.37,22.28 L5.2
N$31
  Top 0.254: R14.1 16.52,14.74 LED4.A
N$32
  Top 0.254: U9.P5 19.37,19.06 R11.1
N$33
  Top 0.203: U9.P3 17.49,21.6 R12.2
N$34
  Top 0.305: 13.82,22.55 13.35,22.55 U3.P$1
  Top 1.016: C21.1 14.61,26.82 D2.C
  Top 1.27: D2.C D1.C | C21.1 14.61,23.34 13.82,22.55
N$35
  Top 0.254: SJ3.3 42.29,8.24 LED3.C
N$36
  Top 0.254: LED3.A 43.92,6.94 R13.1
N$38  (via drill 0.38)
  Top 0.203: U3.P$7 11.83,17.23 v11.43,16.83 | 19.84,12.55 19.84,12.48 v19.85,12.46
  Top 0.254: 19.84,12.55 RN1.8 | v14.92,20.12 R15.1
  Top 0.305: U3.P$10 13.58,18.34 13.97,18.73
  Top 1.27: R15.1 13.97,18.73
  Bottom 0.203: v11.43,16.83 13.02,16.83 R15.1 v14.92,20.12 15.13,20.12 19.85,15.39 v19.85,12.46 | v19.85,12.46
N$39
  Top 0.203: U7.1 14.2,8.28 14.55,7.93 U8.3 15.63,7.97 15.63,9.41 16.56,10.34 R23.1 16.96,10.4 16.96,10.84 17.42,11.31 17.42,12.58 16.67,13.33 R24.2
N$40
  Top 0.203: R22.1 16.52,11.24 15.48,10.19 U7.2
N$42  (via drill 3.2)
  other vias: 60.33,3.18
N$43  (via drill 3.2)
  other vias: 60.33,40.01
PC13  (via drill 0.38)
  Top 0.203: U1.2 35.96,22.15 36.78,21.33 36.78,18.49 36.2,17.91 v36.2,15.78 | v43.18,11.43 SJ3.2
  Bottom 0.203: v36.2,15.78 36.2,13.97 38.73,11.43 v43.18,11.43
RF24_CE
  Top 0.203: U1.59 30.78,15.6 32.53,13.85 37.18,13.85 37.76,14.43 39.52,14.43 42.61,17.51 U2.1
RF24_CS
  Top 0.203: U1.58 30.28,15.44 32.39,13.33 37.47,13.33 38.1,13.97 39.69,13.97 42.73,17.01 U2.2
RF24_IRQ  (via drill 0.38)
  Top 0.203: U1.57 29.78,15.31 32.22,12.86 38.26,12.86 v38.6,13.2 | v44.31,11.4 44.34,11.43 44.34,12.52 45.36,13.54 U2.6
  Bottom 0.203: v38.6,13.2 v38.61,13.2 39.44,12.37 43.34,12.37 v44.31,11.4
RST  (via drill 0.38)
  Top 0.203: C7.1 29.83,9.86 31.12,8.57 31.12,7.95 | v35.24,10.16 S2.1 33.34,9.21 32.07,7.94 R1.1 31.12,7.92 31.12,5.42 29.92,4.22 26.75,4.22 25.4,2.87 JP1.6 | U1.7 34.45,24.65 v33.84,24.04
  Top 0.254: U$2.P$7 28.56,11.75 C7.1 | R1.1 31.12,7.95
  Bottom 0.203: v33.84,24.05 v33.84,24.04 32.92,23.12 32.92,12.48 v35.24,10.16
SPI_MISO  (via drill 0.38)
  Top 0.203: U1.51 26.78,16.4 31.75,11.43 40.37,11.43 v42.7,13.77 44.45,15.51 U2.5 | U4.2 46.34,24.49 v46.36,24.5 | v50.51,21.2 51.43,22.11 U5.2
  Bottom 0.203: v46.36,24.5 49.16,24.5 50.51,23.15 v50.51,21.2 50.51,17.92 49.71,17.11 48.7,17.11 48.31,17.5 42.6,17.5 41.41,16.32 41.41,15.04 42.68,13.77 v42.7,13.77
SPI_MOSI  (via drill 0.38)
  Top 0.203: U4.5 v48.9,27.08 49.57,26.4 52.09,26.4 52.73,27.04 U5.5 | U1.52 27.28,16.52 31.89,11.9 39.67,11.9 v42.7,14.94 43.78,16.01 U2.4
  Bottom 0.203: v42.7,14.94 42.44,14.94 41.98,15.4 41.98,16.26 42.73,17.01 48.23,17.01 48.59,16.65 49.88,16.65 51.26,18.03 51.26,24.3 48.9,26.67 v48.9,27.08
SPI_SCK  (via drill 0.38)
  Top 0.203: v47.62,30.8 U4.6 | U1.53 27.78,16.68 32.07,12.39 39.11,12.39 42.94,16.22 v42.96,16.22 43.26,16.51 U2.3 | v51.75,27.22 52.08,27.54 U5.6
  Bottom 0.203: v47.62,30.8 50.48,30.8 51.75,29.53 v51.75,27.22 51.75,17.78 50.16,16.19 42.96,16.19 v42.96,16.22
SRAM_CS  (via drill 0.38)
  Top 0.203: U1.62 32.28,20.81 32.8,21.33 v33.61,21.33 | v47.92,25.39 50.17,25.39 50.8,24.77 50.8,22.84 U5.1
  Bottom 0.203: v33.61,21.33 33.61,21.55 35.56,23.49 38.73,23.49 40.65,25.41 47.9,25.41 v47.92,25.39
SRAM_HOLD
  Top 0.203: U5.7 51.43,30.46 R4.1
T0
  Top 0.203: U1.38 22.24,26.65 15.57,33.33 13.97,33.33 12.7,34.59 JP2.1
T1
  Top 0.203: U1.37 22.38,27.15 15.24,34.29 JP2.2
TA0
  Top 0.203: U1.36 22.52,27.65 17.78,32.39 JP2.3
TA1
  Top 0.203: U1.35 23.03,28.15 21,30.18 21,34.88 JP2.4
TA2
  Top 0.203: U1.34 23.1,28.65 21.42,30.32 21.42,34.12 JP2.5 22.86,35.81
TA3
  Top 0.203: U1.33 23.59,29.15 21.94,30.8 21.94,32.83 22.4,33.29 24.1,33.29 25.4,34.59 JP2.6
TA4
  Top 0.203: U1.27 28.28,35.22 JP2.7
TA5
  Top 0.203: U1.26 28.78,33.86 JP2.8
TA6  (via drill 0.38)
  Top 0.203: U1.15 35.95,28.65 v36.83,29.53
  Bottom 0.203: v36.83,29.53 36.83,31.75 JP2.9
USB_DISC  (via drill 0.38)
  Top 0.203: U1.54 28.28,20.42 27.97,20.73 26.82,20.73 26.4,21.15 v26.4,21.24 | R25.2 17.48,6.67 U8.1 18.42,6.99 v19.69,8.26
  Bottom 0.203: v19.69,8.26 19.69,8.64 22.4,11.36 22.4,13.15 24.97,15.71 24.97,19.81 v26.4,21.24
USB_DM  (via drill 0.38)
  Top 0.203: U1.44 22.46,23.65 v22.31,23.8
  Top 0.254: U6.6 13.68,14.89 v13.65,14.92
  Bottom 0.203: v22.31,23.8 20.64,22.13 20.64,12.22 19.8,11.38 17.2,11.38 v13.65,14.92
USB_DP  (via drill 0.38)
  Top 0.203: R22.2 U6.4 | v15.22,10.95 R22.2 | U1.45 22.73,23.15 v22.33,22.75
  Top 0.254: R22.2 15.24,12.05
  Top 0.406: R22.2
  Bottom 0.203: v15.22,10.95 19.9,10.95 21.05,12.11 21.05,21.45 22.33,22.73 v22.33,22.75
V+
  Top 0.203: D1.A 9.3,30.93 9.3,30.94
  Top 1.016: 9.3,30.94 7.48,32.75 JP5.2 6.15,32.75 6.15,39.37 6.4,39.62 SJ4.3
VCC  (via drill 0.38)
  Top 0.203: R15.2 16.83,20.01 v16.88,20.07 | LED1.C v5.28,18.01 | 5.08,21.59 LED2.C
  Top 0.254: RN1.5 19.12,15.81 18.73,16.19 18.73,17.13 C23.1
  Top 0.406: R11.2 U9.P4 | JP6.2 4.81,26.4 3.81,25.4 3.81,22.86 5.08,21.59 5.08,19.25 LED1.C
  Top 0.61: C23.1 18.72,17.78 R11.2
  Top 0.813: R15.2 17.77,18.73 18.72,17.78
  Bottom 0.203: v16.88,20.07 16.76,20.07 15.8,21.03 14.6,21.03 13.97,20.4 13.97,19.05 13.11,18.19 5.28,18.19 v5.28,18.01

### Text on the board
_tsilk: Batt | 3.3v | JTAG | LED0 | RESET
_bsilk: Batt | Batt | 32 | 31 | 30 | 29 | 28 | 27 | 26 | 25 | 24 | 23 | 22 | 21 | 20 | 19 | 18 | 17 | T0 | T1 | TA0 | TA1 | TA2 | TA3 | TA4 | TA5 | TA6 | A0 | A1 | A2 | A3 | A4 | A5 | A6 | Vin | Pygmy LP Board v1 | Design By Warren D Greenway and Evan Teitelman | CC-BY-SA | COM1_TX | COM1_RX | COM2_TX | COM2_RX | COM3_TX | COM3_RX | JTRST | RESET | JTMS | JTCK | JTDO | DAC1 | DAC2 | JTDI | MCO | 1 | 2 | 3 | 4 | 5 | 6 | 7 | 8 | 9 | 10 | 11 | 12 | 13 | 14 | 15 | 16